# EAGLE schematic +XPanelNew (EAGLE 6.5.0)
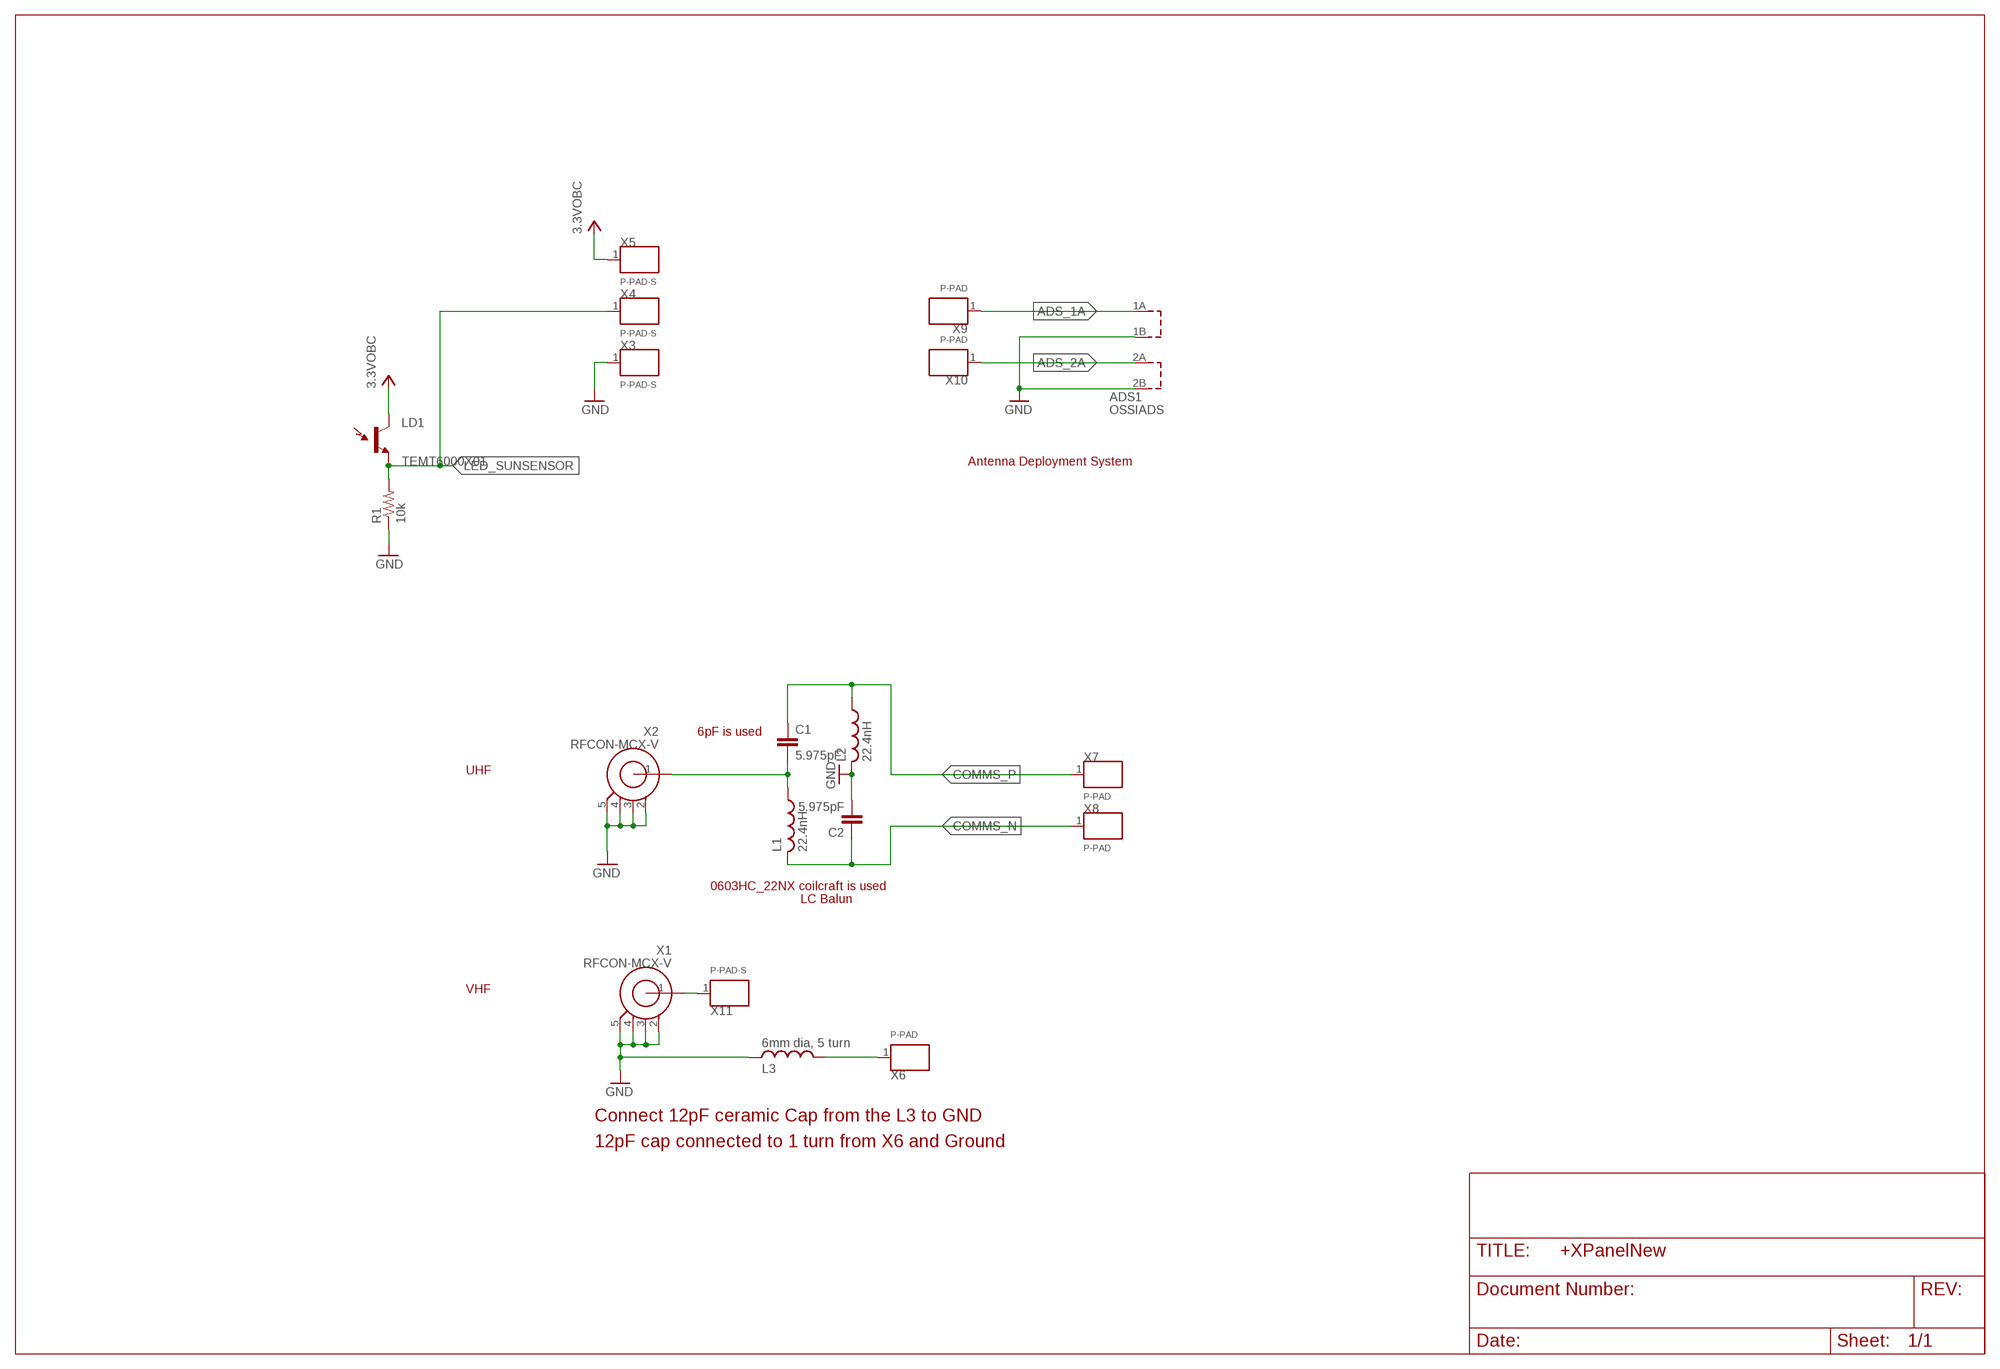
[diagram p0: schematic, sheet 1]

## Parts
ADS1  OSSIADS  [OSSIADS]
C1  5.975pF  C0805(2012)  [C0805(2012)]
C2  5.975pF  C0805(2012)  [C0805(2012)]
L1  22.4nH  L0805(2012)  [L0805(2012)]
L2  22.4nH  L0805(2012)  [L0805(2012)]
L3  6mm dia, 5 turn  L-US0207/10  [0207/10]
LD1  TEMT6000X01  [TEMT6000-SEN]
R1  10k  R0805(2012)  [R0805(2012)]
X1  RFCON-MCX-V  [MCX-V]
X2  RFCON-MCX-V  [MCX-V]
X3  P-PAD-S  [P-PAD-S]
X4  P-PAD-S  [P-PAD-S]
X5  P-PAD-S  [P-PAD-S]
X6  P-PAD  [P-PAD]
X7  P-PAD  [P-PAD]
X8  P-PAD  [P-PAD]
X9  P-PAD  [P-PAD]
X10  P-PAD  [P-PAD]
X11  P-PAD-S  [P-PAD-S]

## Nets
3.3VOBC: LD1.COLLECTOR(C1) X5.1
ADS_1A: ADS1.1A X9.1
ADS_2A: ADS1.2A X10.1
COMMS_N: C2.1 L1.2 X8.1
COMMS_P: C1.1 L2.1 X7.1
GND: ADS1.1B ADS1.2B C2.2 L2.2 L3.2 R1.1 X1.2 X1.3 X1.4 X1.5 X2.2 X2.3 X2.4 X2.5 X3.1
LED_SUNSENSOR: LD1.EMITTER(E1) R1.2 X4.1
N$1: L3.1 X6.1
N$2: X1.1 X11.1
N$45: C1.2 L1.1 X2.1

## Notes on the sheet
- Antenna Deployment System
- 6pF is used
- UHF
- 0603HC_22NX coilcraft is used
- LC Balun
- VHF
- Connect 12pF ceramic Cap from the L3 to GND
- 12pF cap connected to 1 turn from X6 and Ground

## Library data of the parts
ADS1 = OSSI:OSSIADS
C1 C2 = OSSI:C
L1 L2 = OSSI:L
L3 = rcl:L-US: INDUCTOR, American symbol
LD1 = OSSI:TEMT6000: Ambient Light Sensor Simple light detection sensor. Output varies with light intensity input. Spark Fun Electronics SKU : COM-08348
R1 = OSSI:R
X1 X2 = OSSI:RFCON: RF Connectors
X3-X11 = OSSI:P-PAD